# EAGLE design Maple-mini-r2-evolution-board (EAGLE 5.11)
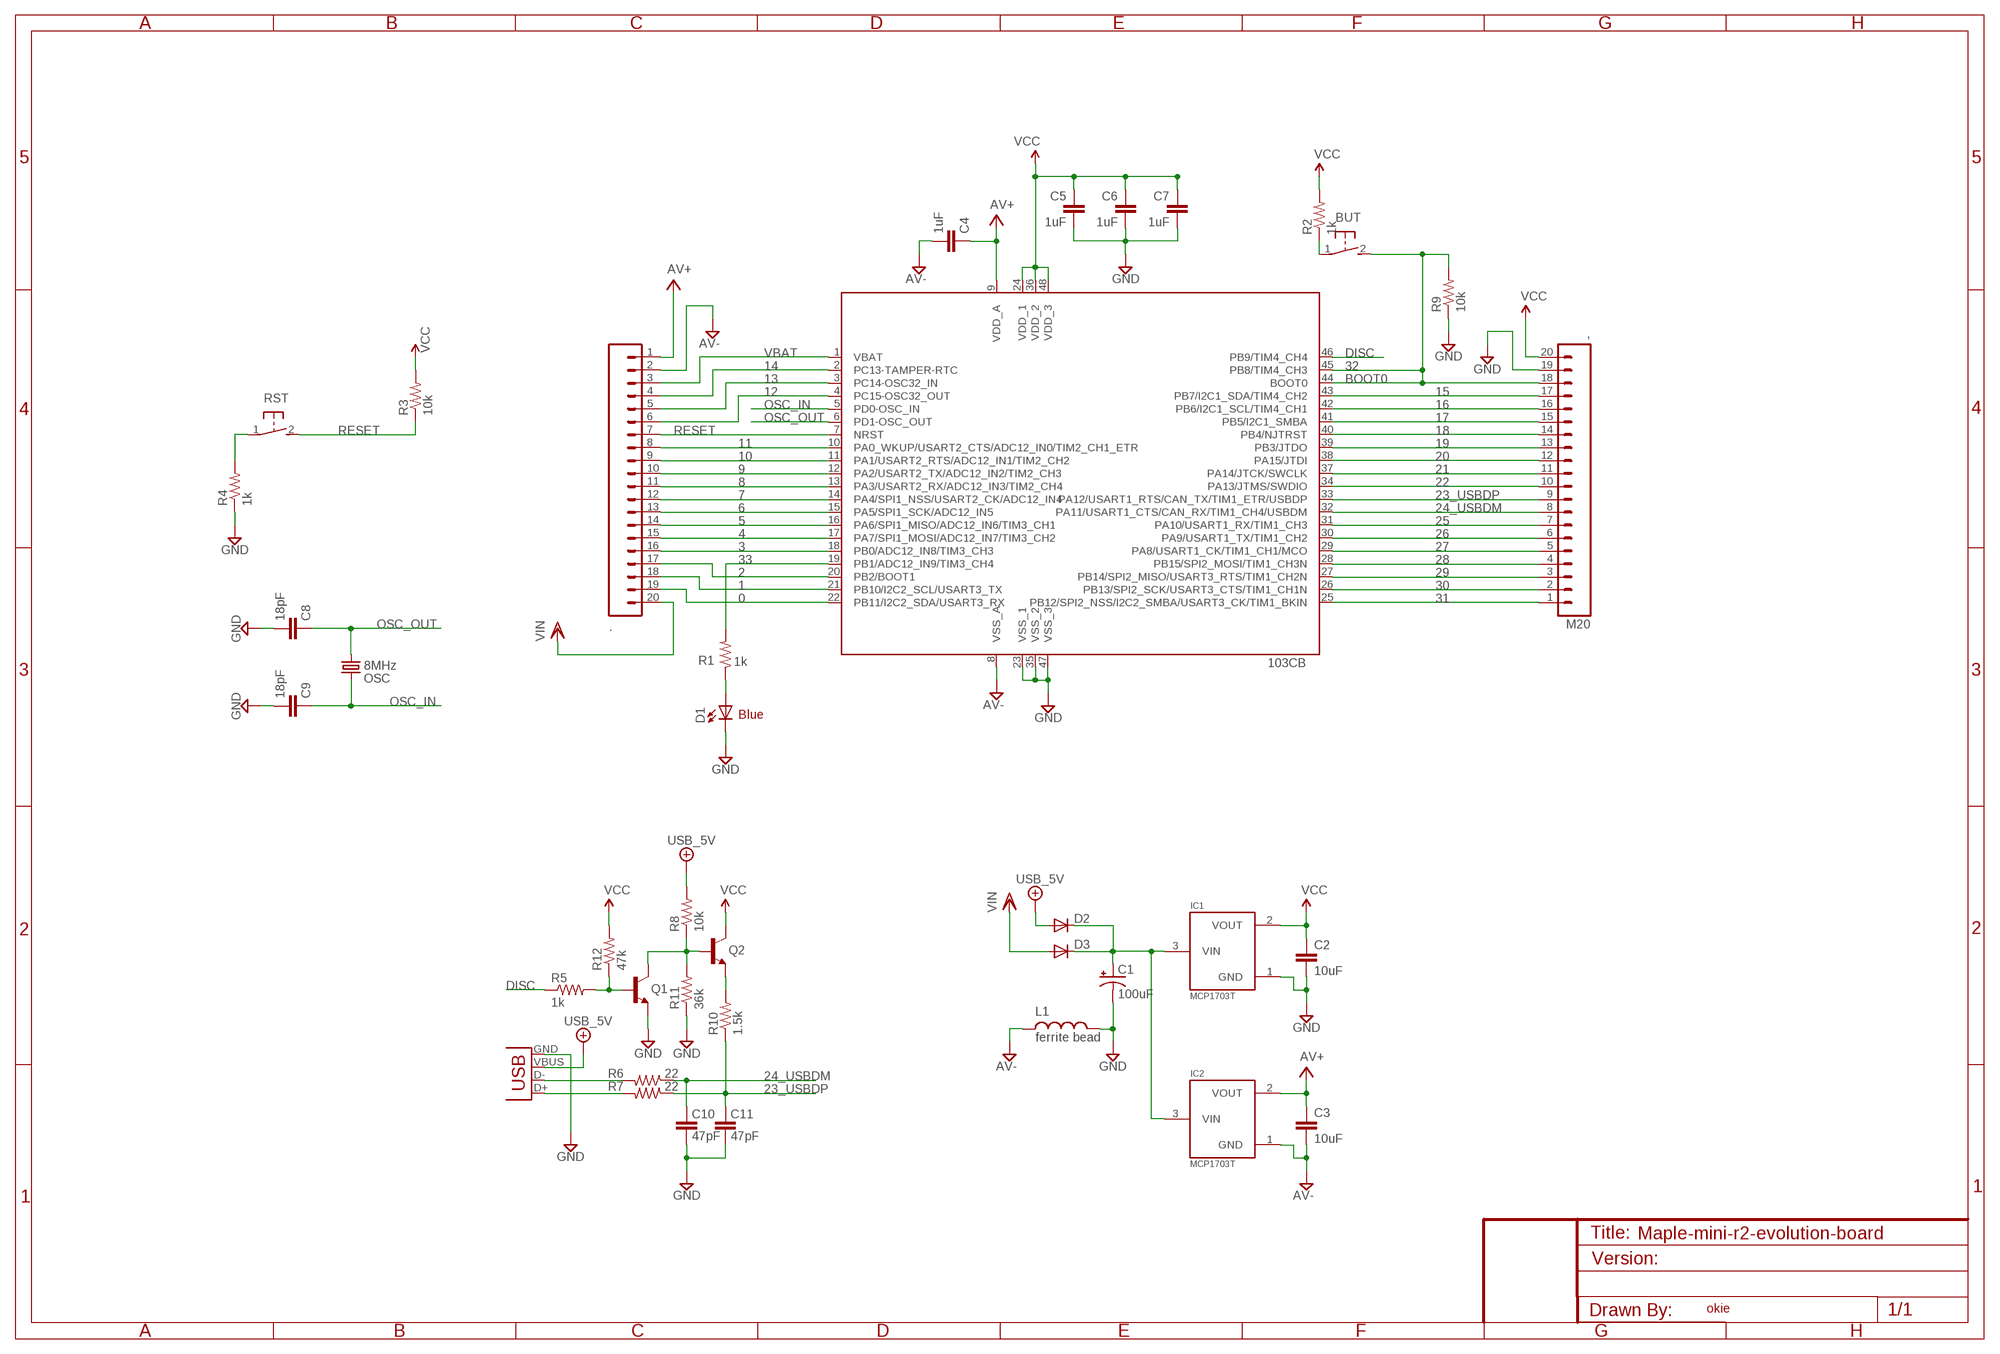
[diagram p0: schematic, sheet 1]

## Parts
103CB  STM32F103CB  [LQFP48]
,  M20  [1X20]
.  M20  [1X20]
BUT  ALPS-TACT  [DTS-6]
C1  100uF  CAP_POL1206  [EIA3216]
C2  10uF  CAP0805  [0805]
C3  10uF  CAP0805  [0805]
C4  1uF  CAP0402  [C0402]
C5  1uF  CAP0402  [C0402]
C6  1uF  CAP0402  [C0402]
C7  1uF  CAP0402  [C0402]
C8  18pF  CAP0402  [C0402]
C9  18pF  CAP0402  [C0402]
C10  47pF  CAP0402  [C0402]
C11  47pF  CAP0402  [C0402]
D1  Blue  LED0603  [LED-0603]
D2  DIODESOD  [SOD-323]
D3  DIODESOD  [SOD-323]
IC1  MCP1703T  MCP1700T  [SOT23]
IC2  MCP1703T  MCP1700T  [SOT23]
L1  ferrite bead  INDUCTOR0603  [0603]
OSC  8MHz  CRYSTAL5X3  [CRYSTAL-SMD-5X3]
Q1  NPN-BJT  TRANSISTOR_NPNSOT23  [SOT23]
Q2  NPN-BJT  TRANSISTOR_NPNSOT23  [SOT23]
R1  1k  RESISTOR0402  [C0402]
R2  1k  RESISTOR0402  [C0402]
R3  10k  RESISTOR0402  [C0402]
R4  1k  RESISTOR0402  [C0402]
R5  1k  RESISTOR0402  [C0402]
R6  22  RESISTOR0402  [C0402]
R7  22  RESISTOR0402  [C0402]
R8  10k  RESISTOR0402  [C0402]
R9  10k  RESISTOR0402  [C0402]
R10  1.5k  RESISTOR0402  [C0402]
R11  36k  RESISTOR0402  [C0402]
R12  47k  RESISTOR0402  [C0402]
RST  ALPS-TACT  [DTS-6]
X1  USB-MINIB  USBSMD  [USB-MINIB]

## Nets
0: 103CB.22(PB11/I2C2_SDA/USART3_RX) ..19
1: 103CB.21(PB10/I2C2_SCL/USART3_TX) ..18
2: 103CB.20(PB2/BOOT1) ..17
3: 103CB.18(PB0/ADC12_IN8/TIM3_CH3) ..16
4: 103CB.17(PA7/SPI1_MOSI/ADC12_IN7/TIM3_CH2) ..15
5: 103CB.16(PA6/SPI1_MISO/ADC12_IN6/TIM3_CH1) ..14
6: 103CB.15(PA5/SPI1_SCK/ADC12_IN5) ..13
7: 103CB.14(PA4/SPI1_NSS/USART2_CK/ADC12_IN4) ..12
8: 103CB.13(PA3/USART2_RX/ADC12_IN3/TIM2_CH4) ..11
9: 103CB.12(PA2/USART2_TX/ADC12_IN2/TIM2_CH3) ..10
10: 103CB.11(PA1/USART2_RTS/ADC12_IN1/TIM2_CH2) ..9
11: 103CB.10(PA0_WKUP/USART2_CTS/ADC12_IN0/TIM2_CH1_ETR) ..8
12: 103CB.4(PC15-OSC32_OUT) ..6
13: 103CB.3(PC14-OSC32_IN) ..5
14: 103CB.2(PC13-TAMPER-RTC) ..4
15: 103CB.43(PB7/I2C1_SDA/TIM4_CH2) ,.17
16: 103CB.42(PB6/I2C1_SCL/TIM4_CH1) ,.16
17: 103CB.41(PB5/I2C1_SMBA) ,.15
18: 103CB.40(PB4/NJTRST) ,.14
19: 103CB.39(PB3/JTDO) ,.13
20: 103CB.38(PA15/JTDI) ,.12
21: 103CB.37(PA14/JTCK/SWCLK) ,.11
22: 103CB.34(PA13/JTMS/SWDIO) ,.10
23_USBDP: 103CB.33(PA12/USART1_RTS/CAN_TX/TIM1_ETR/USBDP) ,.9 C11.2 R7.1 R10.1
24_USBDM: 103CB.32(PA11/USART1_CTS/CAN_RX/TIM1_CH4/USBDM) ,.8 C10.2 R6.1
25: 103CB.31(PA10/USART1_RX/TIM1_CH3) ,.7
26: 103CB.30(PA9/USART1_TX/TIM1_CH2) ,.6
27: 103CB.29(PA8/USART1_CK/TIM1_CH1/MCO) ,.5
28: 103CB.28(PB15/SPI2_MOSI/TIM1_CH3N) ,.4
29: 103CB.27(PB14/SPI2_MISO/USART3_RTS/TIM1_CH2N) ,.3
30: 103CB.26(PB13/SPI2_SCK/USART3_CTS/TIM1_CH1N) ,.2
31: 103CB.25(PB12/SPI2_NSS/I2C2_SMBA/USART3_CK/TIM1_BKIN) ,.1
32: 103CB.44(BOOT0) 103CB.45(PB8/TIM4_CH3) ,.18 BUT.2 R9.2
33: 103CB.19(PB1/ADC12_IN9/TIM3_CH4) R1.2
+5V/2: D2.2(A) R8.2 X1.VBUS ; supply symbol labelled USB_5V
AV+: 103CB.9(VDD_A) ..1 C3.1 C4.1 IC2.2(VOUT)
AV-: 103CB.8(VSS_A) ..2 C3.2 C4.2 IC2.1(GND) L1.1
DGND: 103CB.23(VSS_1) 103CB.35(VSS_2) 103CB.47(VSS_3) ,.19 C1.C(-) C2.2 C5.2 C6.2 C7.2 C8.2 C9.2 C10.1 C11.1 D1.C IC1.1(GND) L1.2 Q1.2(E) R4.1 R9.1 R11.1 X1.GND ; supply symbol labelled GND
DISC: 103CB.46(PB9/TIM4_CH4) R5.1
N$1: BUT.1 R2.1
N$2: D1.A R1.1
N$4: R4.2 RST.1
N$5: C1.A(+) D2.1(C) D3.1(C) IC1.3(VIN) IC2.3(VIN)
N$51: Q2.2(E) R10.2
N$59: R6.2 X1.D-
N$60: R7.2 X1.D+
N$71: Q1.3(C) Q2.1(B) R8.1 R11.2
N$73: Q1.1(B) R5.2 R12.1
OSC_IN: 103CB.5(PD0-OSC_IN) C9.1 OSC.3
OSC_OUT: 103CB.6(PD1-OSC_OUT) C8.1 OSC.1
RESET: 103CB.7(NRST) ..7 R3.1 RST.2
VBAT: 103CB.1(VBAT) ..3
VCC: 103CB.24(VDD_1) 103CB.36(VDD_2) 103CB.48(VDD_3) ,.20 C2.1 C5.1 C6.1 C7.1 IC1.2(VOUT) Q2.3(C) R2.2 R3.2 R12.2
VIN: ..20 D3.2(A)

## Notes on the sheet
- BOOT0
- Blue
- okie

## Library data of the parts
103CB = stm32:STM32F103CB
, . = SparkFun3:M20: This is just like the LOCK variant in that the holes are staggared by 5 mil, but except for the last two holes. They are not altered from the "standard" footprint layout. This is used for a special purpose on the layout of our Graphic LCD Backpack. Make sure you want to use this device before selecting it for you project!
BUT RST = switch-tact:ALPS-TACT
C1 = SparkFun3:CAP_POL: Capacitor Polarized These are standard SMD and PTH capacitors. Normally 10uF, 47uF, and 100uF in electrolytic and tantalum varieties. Always verify the external diameter of the through hole cap, it varies with capacity, voltage, and manufacturer. The EIA devices should be standard.
C2 C3 = SparkFun2:CAP: Capacitor Standard 0603 ceramic capacitor, and 0.1" leaded capacitor.
C4-C11 = SparkFun:CAP: Capacitor Standard 0603 ceramic capacitor, and 0.1" leaded capacitor.
D1 = SparkFun:LED: LEDs Standard schematic elements and footprints for 5mm, 3mm, 1206, and 0603 sized LEDs. 5mm - Spark Fun Electronics SKU : COM-00529 (and others)
D2 D3 = SparkFun3:DIODE: Diode These are standard reverse protection diodes and small signal diodes. SMA package can handle up to about 1A. SOD-323 can handle about 200mA. What the SOD-323 package when ordering, there are some mfgs out there that are 5-pin packages.
IC1 IC2 = okie:MCP1700T
L1 = SparkFun3:INDUCTOR: Inductors Basic Inductor/Choke - 0603 and 1206. Footprints are not proven and vary greatly between part numbers.
OSC = SparkFun2:CRYSTAL: Crystals Various standard crystals. Proven footprints. Spark Fun Electronics SKU : COM-00534
Q1 Q2 = SparkFun2:TRANSISTOR_NPN: Transistor NPN BJT configuration in SOT23 package. MMBT2222 is the common NPN we use. Double check BCE configuration again layout.
R1-R12 = SparkFun:RESISTOR: Resistor Basic schematic elements and footprints for 0603, 1206, and PTH 1/10th watt (small) resistors.
X1 = SparkFun2:USB: USB Connectors USB-B-PTH is fully proven SKU : PRT-00139 USB-miniB is fully proven SKU : PRT-00587 USB-A-PCB is untested. USB-A-H is throughly reviewed, but untested. Spark Fun Electronics SKU : PRT-00437 USB-B-SMT is throughly reviewed, but untested. Needs silkscreen touching up. USB-A-S has not been used/tested USB-MB-H has not been used/tested

## Net classes
1 vcc: width 0.254 mm

## Board
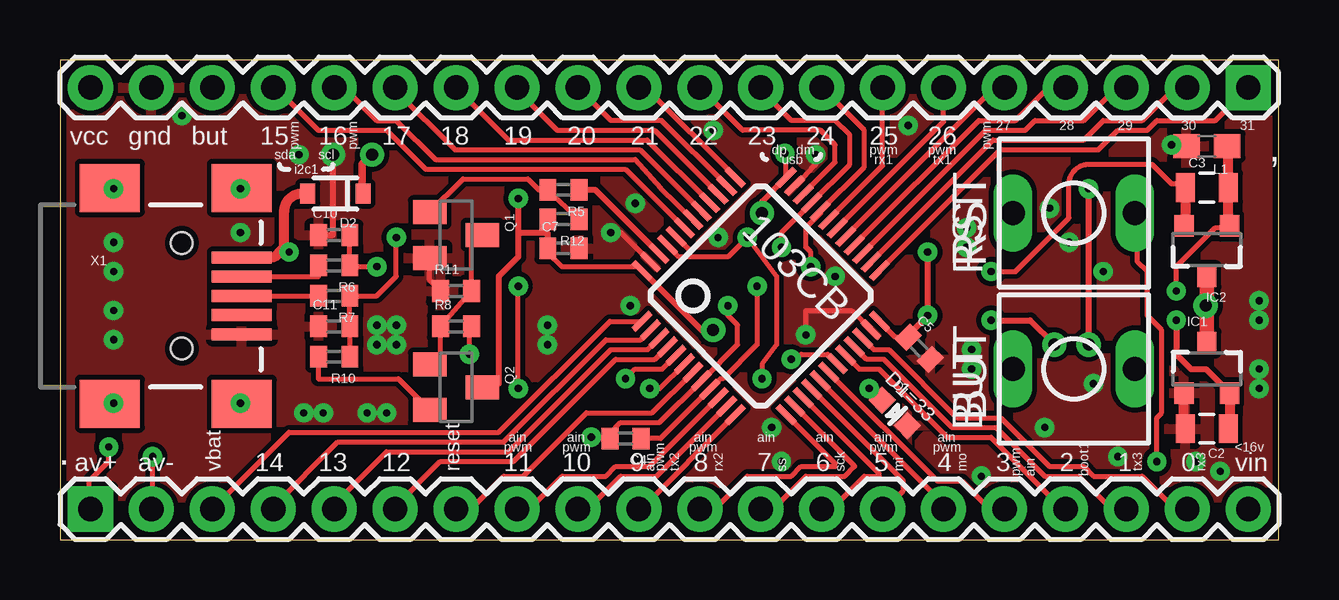
[diagram p1: board, top side]
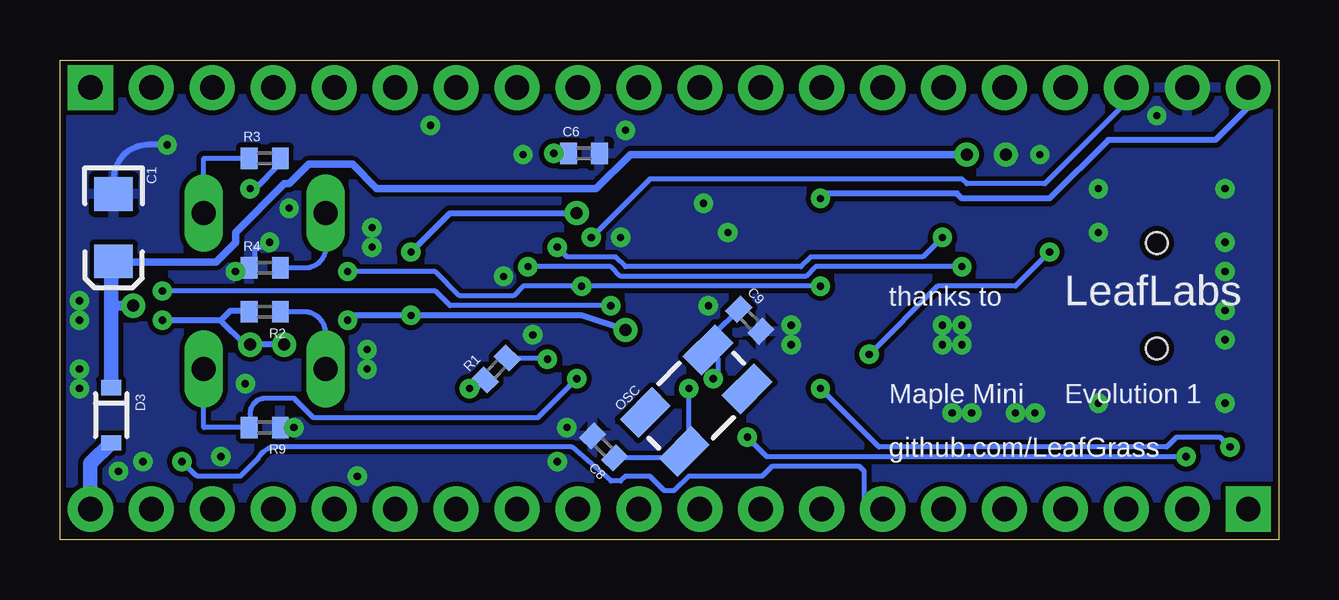
[diagram p2: board, bottom side, seen from below]

Size 50.8 x 20 mm. Coordinates in mm from the lower left corner, seen from the top.
Outline: 0,0 50.8,0 50.8,20 0,20 0,0
Copper layers (1*16): Top 0.035mm / dielectric 1.5mm / Bottom 0.035mm
Design rules "SparkFun": minimum track width 8mil, minimum drill 20mil, track to track 8mil, track to pad 8mil, pad to pad 8mil, via to via 8mil, smd to smd 8mil, copper to edge 10mil, drill to drill 8mil, minimum pad ring 12mil, minimum via ring 10mil, stop-mask expansion 4mil, vias tented up to drill 25mil, thermal gap 10mil

### Footprints (pad centres in the part's own frame; a part is rotated, then mirrored left to right if it is on the bottom)
LQFP48 = smd 0.254 x 1: 1 -2.75,-4.25; 2 -2.25,-4.25; 3 -1.75,-4.25; 4 -1.25,-4.25; 5 -0.75,-4.25; 6 -0.25,-4.25; 7 0.25,-4.25; 8 0.75,-4.25; 9 1.25,-4.25; 10 1.75,-4.25; 11 2.25,-4.25; 12 2.75,-4.25; 25 2.75,4.25; 26 2.25,4.25; 27 1.75,4.25; 28 1.25,4.25; 29 0.75,4.25; 30 0.25,4.25; 31 -0.25,4.25; 32 -0.75,4.25; 33 -1.25,4.25; 34 -1.75,4.25; 35 -2.25,4.25; 36 -2.75,4.25 | smd 1 x 0.254: 13 4.25,-2.75; 14 4.25,-2.25; 15 4.25,-1.75; 16 4.25,-1.25; 17 4.25,-0.75; 18 4.25,-0.25; 19 4.25,0.25; 20 4.25,0.75; 21 4.25,1.25; 22 4.25,1.75; 23 4.25,2.25; 24 4.25,2.75; 37 -4.25,2.75; 38 -4.25,2.25; 39 -4.25,1.75; 40 -4.25,1.25; 41 -4.25,0.75; 42 -4.25,0.25; 43 -4.25,-0.25; 44 -4.25,-0.75; 45 -4.25,-1.25; 46 -4.25,-1.75; 47 -4.25,-2.25; 48 -4.25,-2.75
1X20 = drill 1.016 pad 1.88 square: 1 0,0 | drill 1.016 pad 1.88 round: 2 2.54,0; 3 5.08,0; 4 7.62,0; 5 10.16,0; 6 12.7,0; 7 15.24,0; 8 17.78,0; 9 20.32,0; 10 22.86,0; 11 25.4,0; 12 27.94,0; 13 30.48,0; 14 33.02,0; 15 35.56,0; 16 38.1,0; 17 40.64,0; 18 43.18,0; 19 45.72,0; 20 48.26,0
DTS-6 = drill 1 long: 1 0,2.54; 2 0,-2.54
EIA3216 = smd 1.4 x 1.6: A 1.4,0; C -1.4,0
0805 = smd 0.8 x 1.2: 1 -0.9,0; 2 0.9,0
C0402 = smd 0.7 x 0.9: 1 -0.65,0; 2 0.65,0
LED-0603 = smd 0.8 x 0.8: A 0,-0.75; C 0,0.75
SOD-323 = smd 0.63 x 0.83: 1 -1.15,0; 2 1.15,0
SOT23 = smd 0.8 x 0.9: 1 -0.95,-1; 2 0.95,-1; 3 0,1.1
0603 = smd 1.1 x 1: 1 -0.85,0; 2 0.85,0
CRYSTAL-SMD-5X3 = smd 1.9 x 1.1: 1 -1.85,-1.15; 2 1.85,-1.15; 3 1.85,1.15; 4 -1.85,1.15
SOT23' = smd 1 x 1.4: 1 -0.95,-1.1; 2 0.95,-1.1; 3 0,1.1
USB-MINIB = smd 2.5 x 0.5: D+ 2.5,0; D- 2.5,0.8; GND 2.5,-1.6; ID 2.5,-0.8; VBUS 2.5,1.6 | smd 2.5 x 2: GND@1 -3,-4.5; GND@2 -3,4.5; GND@3 2.5,4.5; GND@4 2.5,-4.5 | hole 0.9: 0,2.2; 0,-2.2

### Placement (x,y rotation side)
103CB  29.21,10.16 315 top
,  49.53,18.85 180 top
.  1.27,1.27 0 top
BUT  42.27,7.11 90 top
C1  48.56,13 270 bottom
C2  47.8,4.62 180 top
C3  47.8,14.68 0 top
C4  23.57,4.22 180 top
C5  35.81,7.98 315 top
C6  28.96,16.1 0 bottom
C7  20.98,12.14 0 top
C8  28.14,3.86 135 bottom
C9  22.05,9.14 315 bottom
C10  11.43,12.7 0 top
C11  11.43,8.89 0 top
D1  34.8,5.28 225 top
D2  11.48,14.43 180 top
D3  48.67,5.18 270 bottom
IC1  47.8,7.11 0 top
IC2  47.8,12.09 180 top
L1  47.8,16.41 180 top
OSC  24.28,5.79 45 bottom
Q1  NPN-BJT  [SOT23']  16.51,12.7 270 top
Q2  NPN-BJT  [SOT23']  16.51,6.35 270 top
R1  32.61,7.11 45 bottom
R2  42.27,9.5 180 bottom
R3  42.27,15.9 0 bottom
R4  42.27,11.33 0 bottom
R5  20.98,14.58 180 top
R6  11.43,11.43 180 top
R7  11.43,10.16 180 top
R8  16.51,8.89 0 top
R9  42.27,4.67 180 bottom
R10  11.43,7.62 180 top
R11  16.51,10.36 0 top
R12  20.98,13.36 180 top
RST  42.27,13.61 90 top
X1  5.08,10.16 0 top

### Tracks (layer width: path | path; a pad name or v marks a point on that pad's centre or on a via)
0
  Top 0.203: 103CB.22 33.92,7.92 34.54,7.92 37.39,5.08 39.22,5.08 41.25,3.05 42.67,3.05 43.08,2.64 45.11,2.64 46.48,1.27 ..19
1
  Top 0.203: 103CB.21 33.62,7.52 34.34,7.52 37.19,4.67 39.01,4.67 41.05,2.64 42.47,2.64 43.84,1.27 ..18
2
  Top 0.203: 103CB.20 33.32,7.11 34.14,7.11 36.98,4.27 38.81,4.27 41.81,1.27 ..17
3
  Top 0.203: 103CB.18 36.58,2.44 37.59,2.44 38.76,1.27 ..16
4
  Top 0.203: 103CB.17 36.83,1.48 ..15
5
  Top 0.203: 103CB.16 35.15,2.45 35.15,2.03 34.39,1.27 ..14
6
  Top 0.203: 103CB.15 34.14,2.76 34.14,2.64 33.53,2.64 32.16,1.27 ..13
7
  Top 0.203: 103CB.14 33.12,3.07 33.12,3.05 32.72,2.64 31.09,2.64 29.72,1.27 ..12
8
  Top 0.203: 103CB.13 32.31,3.17 32.31,3.05 30.89,3.05 30.48,2.64 28.65,2.64 27.28,1.27 ..11
9
  Top 0.203: 103CB.12 24.21,1.27 ..10
10
  Top 0.203: 103CB.11 24.87,2.64 23.37,2.64 22,1.27 ..9
11
  Top 0.203: 103CB.10 24.57,3.05 23.16,3.05 22.76,2.64 20.93,2.64 19.56,1.27 ..8
12
  Top 0.203: 103CB.4 24.8,7.52 23.16,7.52 18.9,3.25 15.85,3.25 13.97,1.37 ..6
13
  Top 0.203: 103CB.3 24.5,7.92 22.96,7.92 18.69,3.66 13.61,3.66 11.43,1.47 ..5
14
  Top 0.203: 103CB.2 24.2,8.33 22.76,8.33 18.49,4.06 11.58,4.06 8.89,1.37 ..4
15
  Top 0.203: ,.17 8.99,18.85 10.77,17.07 13.61,17.07 15.24,15.44 23.57,15.44 25.82,13.19 103CB.43
16
  Top 0.203: ,.16 11.84,18.85 13.21,17.48 14.02,17.48 15.65,15.85 23.98,15.85 25.03,14.66 103CB.42
17
  Top 0.203: 103CB.41 24.18,16.26 16.46,16.26 13.97,18.75 ,.15
18
  Top 0.203: 16.46,18.9 ,.14 18.69,16.66 24.48,16.66 103CB.40
19
  Top 0.203: ,.13 18.95,18.85 20.73,17.07 24.78,17.07 103CB.39
20
  Top 0.203: 103CB.38 25.08,17.48 22.96,17.48 ,.12 21.39,19.05
21
  Top 0.203: 103CB.37 24.41,18.85 ,.11
22
  Top 0.203: ,.10 28.45,17.07 31.7,17.07 32.31,16.46 32.31,15.73 103CB.34
23_USBDP  (via drill 0.3)
  Top 0.203: R10.1 C11.2 R7.1 13.21,10.16 14.02,10.97 v14.02,12.6 | v30.07,12.19 30.07,12.8 31.29,14.02 103CB.33 32.92,15.64 32.92,16.87 32.31,17.48 30.48,17.48 29.21,18.75 ,.9
  Bottom 0.203: v30.07,12.19 29.67,11.79 27.64,11.79 27.23,11.38 19.91,11.38 19.51,11.79 14.83,11.79 v14.02,12.6
24_USBDM  (via drill 0.3)
  Top 0.203: C10.2 R6.1 12.19,11.38 v13.21,11.38 | v31.29,11.38 31.29,11.99 31.09,12.19 31.09,13.01 31.7,13.61 103CB.32 33.53,15.54 33.53,17.07 ,.8
  Bottom 0.203: v31.29,11.38 27.84,11.38 27.43,10.97 19.71,10.97 19.3,11.38 v13.21,11.38
25
  Top 0.203: 103CB.31 34.29,15.59 ,.7
26
  Top 0.203: 103CB.30 36.83,17.43 ,.6
27
  Top 0.203: 103CB.29 39.16,19.05 ,.5
28
  Top 0.203: 103CB.28 38.29,17.48 39.83,17.48 41.2,18.85 ,.4
29
  Top 0.203: 103CB.27 38.59,17.07 40.23,17.07 40.64,17.48 42.67,17.48 44.04,18.85 ,.3
30
  Top 0.203: 103CB.26 38.89,16.66 42.67,16.66 43.48,17.48 45.11,17.48 46.48,18.85 ,.2
31
  Top 0.203: 103CB.25 39.2,16.26 43.28,16.26 44.09,17.07 45.31,17.07 45.72,17.48 48.16,17.48 ,.1
32  (via drill 0.3)
  Top 0.203: 103CB.45 25.4,12.19 25.81,11.79 26.21,11.79 | 26.21,11.79 27.84,11.79 v28.65,12.6 29.87,10.97 29.87,8.13 29.26,7.32 v29.26,6.71 | 103CB.44 26.21,12.1 26.21,11.79
  Bottom 0.203: BUT.2 44.81,4.67 R9.2 42.88,4.67 42.88,5.25 arc90 42.23,5.89 41.05,5.89 40.23,5.08 30.89,5.08 v29.26,6.71 | ,.18 6.35,18.24 9.75,14.83 13.01,14.83 13.21,15.04 26.21,15.04 v28.65,12.6
33  (via drill 0.3)
  Top 0.203: 103CB.19 32,7.72 30.89,7.72 30.68,7.52 v30.48,7.52
  Bottom 0.203: v30.48,7.52 30.53,7.57 R1.2
+5V/2  (via drill 0.3)
  Top 0.203: v17.07,7.72 17.07,8.74 R8.2 | 9.25,12.09 v9.55,11.99
  Top 0.406: X1.VBUS 7.61,11.79 8.94,11.79 9.25,12.09 9.35,12.19 9.35,13.7 arc-90 10.08,14.43 D2.2
  Bottom 0.203: v17.07,7.72 14.22,10.57 10.97,10.57 v9.55,11.99
AV+  (via drill 0.3)
  Top 0.203: C4.1 25.03,4.22 103CB.9 27.52,6.71 27.64,6.71 29.06,8.13 v29.06,10.57 | ..1 1.22,1.42 1.22,2.44 2.03,3.25 v2.03,3.86 | v19.1,6.3 v19.1,10.57 | v38.81,11.18 39.83,11.18 42.06,13.41 42.06,14.91 arc-90 43,15.65 45.52,15.65 46.33,14.83 46.74,14.83 C3.1
  Top 0.406: IC2.2 46.9,13.14 C3.1
  Bottom 0.203: v2.03,3.86 2.44,4.27 4.27,4.27 4.67,3.86 16.66,3.86 v19.1,6.3 | v19.1,10.57 v29.06,10.57 29.26,10.36 29.46,10.57 31.5,10.57 31.9,10.16 34.14,10.16 35.15,11.18 v38.81,11.18
AV-  (via drill 0.3)
  Top 0.203: C4.2 22.92,4.43 23.37,4.88 24.99,4.88 103CB.8 26.82,6.71 28.25,8.13 28.25,8.94 27.84,9.35 v27.84,9.75 | ..2 3.86,1.42 v3.86,3.45 | C4.2 22.76,3.86 | v46.53,10.36 46.53,11.38 48.16,13.01 48.56,13.01 IC2.1 | 22.36,4.06 v22.15,4.27 22.2,4.22 C4.2
  Top 0.406: IC2.1 48.7,13.14 C3.2 48.7,16.36 L1.1
  Bottom 0.203: v27.84,9.75 34.54,9.75 35.15,10.36 v46.53,10.36 | v3.86,3.45 21.34,3.45 v22.15,4.27
DGND  (via drill 0.3, 0.5)
  Top 0.203: 103CB.35 31.11,15.24 | 31.11,15.24 | R11.1 15.41,10.81 Q1.2 | 103CB.47 23.39,12.8 v22.96,12.8 | v31.09,8.53 31.09,9.55 33,9.55 103CB.23 | 31.11,15.24 31.5,15.63 v31.5,16.05
  Top 0.254: C10.1 11.38,12.7 v11.38,16.05 | v46.33,16.46 46.95,16.46 L1.2
  Top 0.406: C2.2 46.85,4.67 IC1.1
  Bottom 0.203: v42.06,12.39 42.06,12.19 42.67,12.19 42.67,11.33 R4.1 43.48,11.33 v43.48,11.18
  Bottom 0.254: v46.33,16.46 47.13,16.46 arc-90 48.56,15.02 C1.C
  other vias: 2.24,12.4 2.24,8.33 10.16,5.28 10.97,5.28 9.96,16.05 5.08,17.68 20.32,8.13 20.32,8.94 14.02,8.94 23.98,14.02 27.23,17.07 32.31,10.97 37.8,13 37.8,12.19 38,7.92 38,7.11 41.05,4.67 44.09,3.45 43.08,6.5 38.4,2.64 47.35,3.25 48.36,2.84 41.25,13.82 2.24,14.63 7.52,14.63 7.52,5.69 2.24,5.69 35.36,17.27 7.52,12.8 30.07,3.25 29.67,4.67 2.24,11.18 2.24,9.55 14.02,8.13 13.21,8.13 13.21,8.94 13.61,5.28 12.8,5.28 23.77,9.75 27.43,12.6 49.99,9.96 49.99,9.14 49.99,7.11 49.99,6.3
  pour Bottom: 0,19.91 50.8,19.91 50.8,0 0,0
  pour Top: 0,19.91 50.8,19.91 50.8,0 0,0
DISC
  Top 0.254: 103CB.46 22.32,14.58 R5.1
N$1
  Bottom 0.203: BUT.1 39.73,8.6 arc-90 40.63,9.5 R2.1
N$2  (via drill 0.3)
  Top 0.203: v33.73,6.3 34.42,5.61 D1.A
  Bottom 0.203: R1.1 33.63,6.1 v33.73,6.3
N$4
  Bottom 0.203: R4.2 40.57,11.33 arc-90 39.73,12.17 RST.1
N$5  (via drill 0.5)
  Top 0.305: D2.1 12.6,14.43 12.6,15.65 v13.01,16.05
  Top 0.406: v47.75,9.75 47.8,9.75
  Top 0.61: IC1.3 47.8,9.75 IC2.3
  Bottom 0.305: C1.A 48.36,11.58 44.3,11.58 43.48,12.39 43.48,12.8 41.45,14.83 41.25,14.83 40.44,15.65 38.61,15.65 37.59,14.63 28.45,14.63 27.03,16.05 v13.01,16.05
  Bottom 0.406: 48.67,9.75 v47.75,9.75
  Bottom 0.61: C1.A 48.67,11.5 48.67,9.75 D3.1
N$51
  Top 0.203: Q2.2 14.1,6.71 10.77,6.71 10.78,6.72 R10.2
N$59
  Top 0.203: X1.D- 10.78,10.96 R6.2
N$60
  Top 0.203: X1.D+ R7.2
N$71
  Top 0.203: Q1.3 17.16,12.25 R11.2 R8.1 15.86,7.75 Q2.1
N$73
  Top 0.203: R12.1 R5.2 19.96,14.58 19.51,15.04 16.8,15.04 Q1.1
OSC_IN  (via drill 0.3)
  Top 0.203: 103CB.5 25.1,7.11 23.98,7.11 v23.57,6.71
  Bottom 0.203: C9.1 23.58,8.53 OSC.3 23.99,7.71 23.56,7.71 23.37,7.52 23.37,6.91 v23.57,6.71
OSC_OUT  (via drill 0.3)
  Top 0.203: 103CB.6 25,6.3 v24.59,6.3
  Bottom 0.203: C8.1 25.05,3.4 OSC.1 24.78,3.47 24.38,4.27 24.59,4.47 v24.59,6.3
RESET  (via drill 0.3)
  Top 0.203: 103CB.7 24.69,5.28 21.95,5.28 19.3,2.64 18.49,2.64 17.12,1.27 ..7 | RST.2 44.91,13.61 44.91,11.58 45.31,11.18 45.31,9.35 45.92,8.74 45.92,5.28 45.72,5.08 v45.72,3.25
  Bottom 0.203: R3.1 44.81,15.9 RST.2 | ..7 16.66,1.22 17.27,1.22 17.27,2.85 17.48,3.05 21.13,3.05 21.54,2.64 24.59,2.64 25.2,2.03 25.6,2.03 26.21,2.64 27.23,2.64 27.43,2.44 27.84,2.44 29.46,3.86 41.96,3.86 arc-45 42.54,3.38 43.28,2.64 45.01,2.64 arc45 45.19,2.72 v45.72,3.25
VBAT
  Top 0.203: 103CB.1 22.92,9.1 18.29,4.47 9.55,4.47 ..3
VCC  (via drill 0.3, 0.5)
  Top 0.203: 103CB.24 34.82,8.44 C5.1 | 103CB.48 24.1,11.38 20.93,11.38 20.33,11.98 C7.1 R12.2 | 103CB.36 30.27,16.05 arc90 v30.22,16.1
  Top 0.254: 19.1,12.8 19.1,11.79 18.29,10.97 18.29,6.5 18.09,6.3 17.68,6.3 Q2.3 | 19.1,12.8 20.32,12.8 C7.1 | C5.1 35.36,8.53 35.97,9.14 36.17,9.14 v36.17,9.35 v36.17,11.99 | v46.53,9.14 46.53,7.72 47.14,7.11 47.75,7.11 IC1.2 48.56,6.3 | v41.45,8.13 40.44,9.14 v38.81,9.14 | v42.88,8.13 v42.88,14.63 | v19.1,14.22 19.1,12.8 | 103CB.48 26.74,8.74 v27.23,8.74 | 103CB.36 29.26,14.1 v29.26,13.61
  Top 0.406: C2.1 48.75,4.67 IC1.2
  Bottom 0.203: v30.22,16.1 C6.1
  Bottom 0.254: 44.09,9.14 v46.53,9.14 | 44.09,9.14 43.08,8.13 v42.88,8.13 v41.45,8.13 | v38.81,9.14 38.61,9.35 v36.17,9.35 29.06,9.35 v27.23,8.74 | v36.17,11.99 34.54,13.61 v29.26,13.61 | v42.88,14.63 42.67,14.63 41.66,15.65 41.66,15.85 R3.2 | 44.09,9.14 43.69,9.55 43.08,9.55 R2.2 | v19.1,14.22 18.9,14.43 13.41,14.43 13.21,14.22 9.55,14.22 7.11,16.66 2.64,16.66 1.27,18.03 ,.20
VIN
  Bottom 0.61: D3.2 49.53,3.17 ..20

### Text on the board
tPlace: 27 | 28 | 29 | 30 | 31 | vcc | gnd | but | 15 | sda | pwm | 16 | scl | pwm | 17 | 18 | 19 | 20 | 21 | 22 | 23 | dp | usb | dm | 24 | 25 | pwm | rx1 | 26 | pwm | tx1 | pwm | i2c1 | RST | BUT | D1=33 | pwm | ain | pwm | ain | pwm | ain | ain | ain | pwm | ain | pwm | ain | <16v | av+ | av- | vbat | 14 | 13 | 12 | reset | 11 | 10 | 9 | ain | pwm | tx2 | 8 | rx2 | 7 | ss | 6 | sck | 5 | mi | 4 | mo | 3 | pwm | ain | 2 | boot1 | 1 | tx3 | 0 | rx3 | vin
bPlace: LeafLabs | thanks to | Evolution 1 | Maple Mini | github.com/LeafGrass
Measures: 0.00 mm | 20.00 mm | 0.00 mm | 0.00 mm | Maple mini-r2 evolution board | 0.00 mm | 50.8 x 20.0 mm,Thickness 1.6mm,Copper 35um. | 50.80 mm